# Altium schematic sheet LSM6DS3TR-C.SchDoc
size A4; SheetNumber: 12; SheetTotal: 17
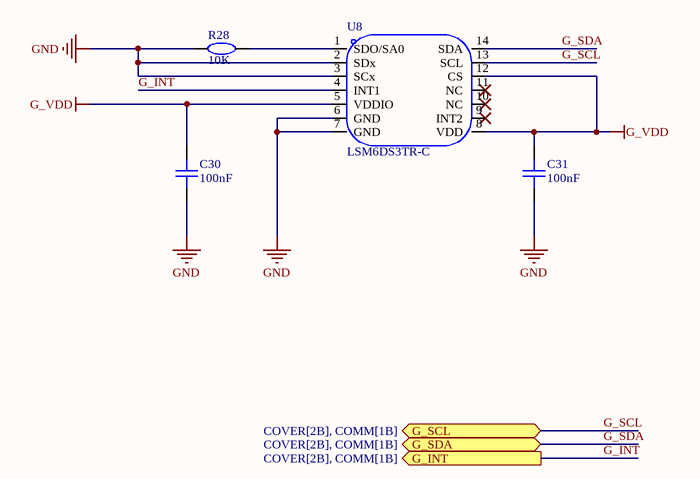
[diagram p0: LSM6DS3TR-C.SchDoc]

## Parts
C30  100nF  [C0402]
C31  100nF  [C0402]
R28  10K  [R0402]
U8  LSM6DS3TR-C  [LGA-14_L3.0-W2.5-P0.50-TL]

## Ports
G_INT (out, see COVER[2B], COMM[1B]), G_SCL (bidir, see COVER[2B], COMM[1B]), G_SDA (bidir, see COVER[2B], COMM[1B])

## Nets
G_VDD: C30.2 C31.2 U8.5(VDDIO) U8.8(VDD) U8.12(CS)
GND: C30.1 C31.1 R28.1 U8.2(SDx) U8.3(SCx) U8.6(GND) U8.7(GND)
G_INT: U8.4(INT1) ; port G_INT
G_SCL: U8.13(SCL) ; port G_SCL
G_SDA: U8.14(SDA) ; port G_SDA
NetR28_2: R28.2 U8.1(SDO/SA0)

Not connected (* = marked no-connect by the designer): U8 9(INT2)* 10(NC)* 11(NC)*

## Library data of the parts
C30 C31 = CAP_0402: Symbol: CapAcitance; Device: CAP_0603; Convert to PCB: yes; Add into BOM: yes; Supplier Footprint: 0603; Value: 100nF; Name: 100nF
R28 = Res_0402: Symbol: 电阻; Device: Res_0603; Convert to PCB: yes; Add into BOM: yes; Supplier Footprint: 0603; Value: 10K; Name: 10K
U8 = LSM6DS3TR-C: Manufacturer: ST(意法半导体); Add into BOM: yes; Sensor Type: 加速度计陀螺仪; Symbol: LSM6DS3TR-C; Device: LSM6DS3TR-C; LCSC Part Name: IMU-惯性测量单元; Supplier Part: C967633; Manufacturer Part: LSM6DS3TR-C; Supplier Footprint: LGA-14(2.5x3); Datasheet: https://atta.szlcsc.com/upload/public/pdf/source/20210226/C967633_4D8B3A108D63359423D57B97CE5134B1.pdf; Supplier: LCSC; Convert to PCB: yes; Operating Temperature: -40℃~+85℃; Name: LSM6DS3TR-C